# Altium schematic sheet Top Level.SchDoc
size A4; SheetNumber: 1; SheetTotal: 1
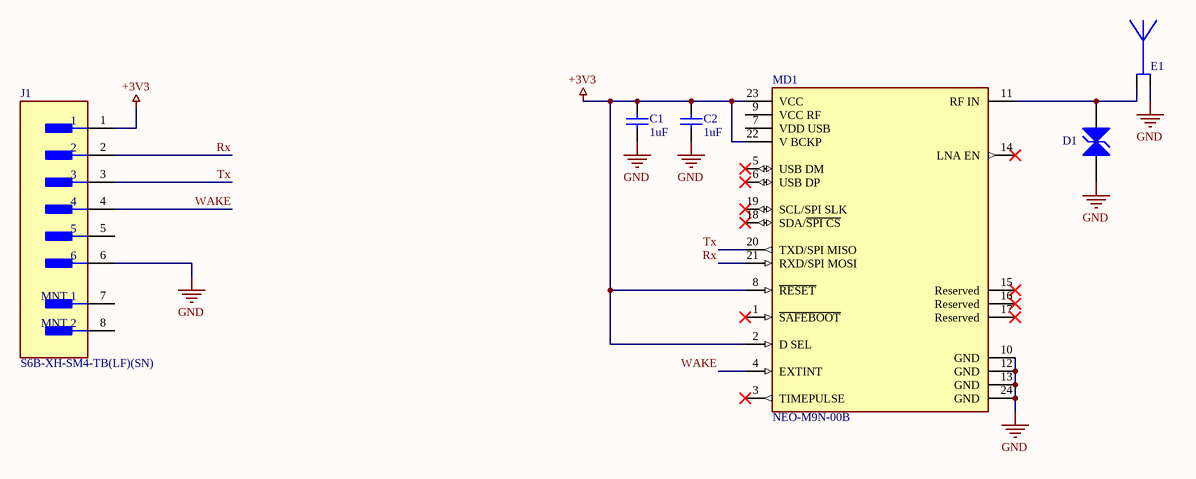
[diagram p0: Top Level.SchDoc]

## Parts
C1  value 1uF  [CAPC1608X10N]  (hidden comment: C0603C105K8PACTU)
C2  value 1uF  [CAPC1608X10N]  (hidden comment: C0603C105K8PACTU)
D1  CGA0402MLC-05G  [DIOC1005X04N]  (value not drawn)
E1  SGGP.25.4.A.02  [SGGP.25.4.A.02-Footprint-1]  (value not drawn)
J1  S6B-XH-SM4-TB(LF)(SN)  [FP-S6B-XH-SM4-TB_LF_SN-MFG]
MD1  NEO-M9N-00B  [FP-NEO-M9N-00B-MFG]

## Nets
+3V3: C1.2 C2.2 J1.1 MD1.2(D_SEL) MD1.8(~{RESET}) MD1.22(V_BCKP) MD1.23(VCC)
GND: C1.1 C2.1 D1.1 E1.2(GND) J1.6 MD1.10(GND) MD1.12(GND) MD1.13(GND) MD1.24(GND)
Rx: J1.2 MD1.21(RXD/SPI_MOSI)
Tx: J1.3 MD1.20(TXD/SPI_MISO)
WAKE: J1.4 MD1.4(EXTINT)
NetD1_2: D1.2 E1.1(ANT) MD1.11(RF_IN)

Not connected (* = marked no-connect by the designer): J1 5 7(MNT_1) 8(MNT_2); MD1 1(~{SAFEBOOT})* 3(TIMEPULSE)* 5(USB_DM)* 6(USB_DP)* 7(VDD_USB) 9(VCC_RF) 14(LNA_EN)* 15(Reserved)* 16(Reserved)* 17(Reserved)* 18(SDA/~{SPI_CS})* 19(SCL/SPI_SLK)*

## Library data of the parts
C1 C2 = CMP-00045-1: Cap Ceramic 1uF 10V X5R 10% SMD 0603 85°C Paper T/R; Capacitance: 1uF; Voltage Rating (DC): 10V; Case/Package: 0603; Height: 0.8mm; Tolerance: 10%; Width: 0.031inch; Lead Free: Lead Free; Mount: Surface Mount; Length: 1.6mm; Number of Pins: 2; Radiation Hardening: No; Dielectric: X5R; Voltage: 10V; Depth: 0.8mm; Weight: 7.1E-05oz; REACH SVHC: No SVHC; Package Quantity: 1; Max Operating Temperature: 85°C; Case Code (Imperial): 0603; Thickness: 0.035inch; Min Operating Temperature: -55°C; Dielectric Material: Ceramic; Case Code (Metric): 1608; Packaging: Tape and Reel; Voltage Rating: 10V; Termination: SMD/SMT
D1 = CMP-00164-1: ESD Suppressor TVS 5V Automotive 2-Pin Case 0402 T/R; Direction: Bidirectional; Number of Circuits: 1; Capacitance: 0.2pF; Clamping Voltage: 30V; Element Configuration: Single; ESD Protection: Yes; Leakage Current: 10nA; Max Reverse Leakage Current: 5nA; Package Quantity: 10000; Operating Supply Voltage: 5V; Max Operating Temperature: 125°C; Max Voltage Rating (DC): 5V; Mount: Surface Mount; Depth: 0.5mm; Length: 1mm; Width: 0.5mm; Voltage Rating (DC): 5V; Number of Pins: 2; Termination: SMD/SMT; Min Operating Temperature: -55°C; REACH SVHC: No SVHC; Case/Package: 0402; Working Voltage: 5V; Radiation Hardening: No; Height: 0.34mm; Packaging: Tape and Reel; Contact Plating: Tin; Case Code (Imperial): 0402; Case Code (Metric): 1005; Current Rating: 5nA
E1 = CMP-00032-2: ANTENNA GPS CERAMIC PATCH SMD; Max Frequency: 1.607GHz; Impedance: 50R; Number of Bands: 2; Mount: Surface Mount; Case/Package: SMD/SMT; Package Quantity: 200; Height: 0.177inch; Termination: Solder
J1 = CMP-17439-000164-1: CONN HEADER SMD R/A 6POS 2.5MM; Gender: Male; Number of Positions: 6; Max Current Rating: 3A; Voltage Rating: 250V; Contact Resistance: 20mR; Flammability Rating: UL94 V-0; Orientation: Right Angle; Contact Finish - Mating: TIN; Packaging: Tape and Reel; Termination: Solder; Pitch: 2.5mm; Housing Color: Beige; Insulation Material: Nylon; Fastening Type: Detent; Housing Material: Polyamide; Package Quantity: 1; Mount: Surface Mount; Insulation Color: Natural; Series: XH; Depth: 7mm; Contact Shape: Square; Color: Natural; Max Voltage Rating (AC): 250V; Min Operating Temperature: -25°C; Number of Contacts: 6; Lead Free: Lead Free; Contact Material: Copper Alloy; Contact Type: Male Pin; Length: 20mm; Max Operating Temperature: 85°C; Connector Type: Header; Number of Rows: 1; REACH SVHC: No SVHC; Contact Plating: Copper
MD1 = CMP-207130-000006-2: M9 standard precision module; Manufacturer: u-blox; Min Supply Voltage: 1.65V; Sensitivity: -167dBm; Interface: I2C,SPI,UART,USB; Max Supply Voltage: 3.6V; Device Class L3: RF Receivers; Category: UNK; Temperature Range Low: -40°C; Temperature Range High: +85°C; ComponentLink2Description: Datasheet; Manufacturer Part Number: NEO-M9N-00B; ComponentLink2URL: https://www.u-blox.com/sites/default/files/NEO-M9N_DataSheet_%28UBX-19014285%29.pdf; Footprint Url: https://www.u-blox.com/sites/default/files/NEO-M9N_Integrationmanual_%28UBX-19014286%29.pdf; Height: 2.6mm; Automotive: No; RoHS: TRUE; Lead Free: Yes; Octopart: https://octopart.com/neo-m9n-00b-u-blox-107315722; Package: 0; Temperature: -40°C to +85°C; Device Class L1: Integrated Circuits (ICs); Device Class L2: RF Semiconductors and Devices